# EAGLE schematic transistorAndResistorWithSupply (EAGLE 7.4.0)
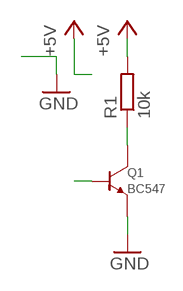
[diagram p0: schematic, sheet 1]

## Parts
Q1  BC547  TRANSISTOR-NPN-GENERICDEFAULT-SOT23-BEC  [SOT23]
R1  10k  R-EU_R0603  [R0603]

## Nets
+5V: R1.2
BASE: Q1.P$1(BASE)
COLLECTOR: Q1.P$3(COLLECTOR) R1.1
GND: Q1.P$2(EMITTER)

## Library data of the parts
Q1 = p.peter-scoville.tests:TRANSISTOR-NPN-GENERIC; SV_SPICE_MODEL: NPN (); SV_SPICE_ORDER: COLLECTOR;BASE;EMITTER; SV_SPICE_PREFIX: Q
R1 = p.peter-scoville.tests:R-EU_: RESISTOR, European symbol; SV_SPICE_ORDER: 1;2; SV_SPICE_PREFIX: R